# Altium schematic sheet LevelShift.SchDoc
size A4; CompanyName2: TH Nürnberg; Author: T. Kreppel; CompanyName: Universidad de Santiago de Chile; Organization: USACH DIE; Address1: Avenida Ecuador Nº 3519; Address2: Estación Central, Santiago90489 Nürnberg; Address3: Chile; SheetNumber: 3; SheetTotal: 5
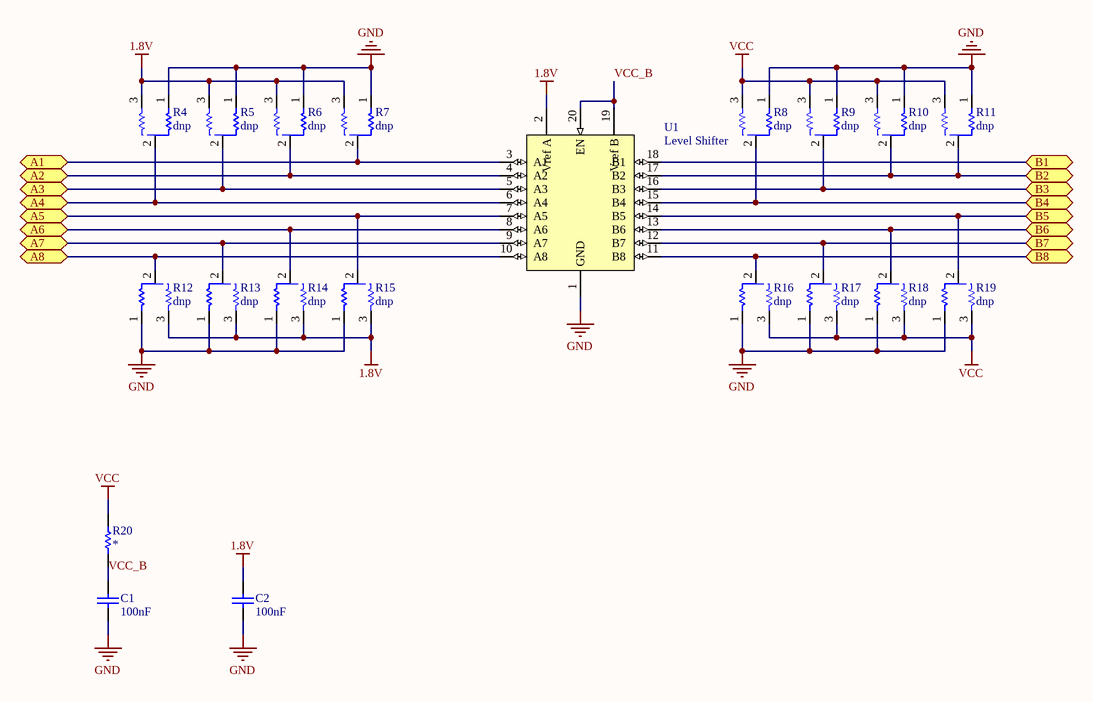
[diagram p0: LevelShift.SchDoc]

## Parts
C1  100nF  [CAP_0603]
C2  100nF  [CAP_0603]
R4  dnp  [0603_Config]
R5  dnp  [0603_Config]
R6  dnp  [0603_Config]
R7  dnp  [0603_Config]
R8  dnp  [0603_Config]
R9  dnp  [0603_Config]
R10  dnp  [0603_Config]
R11  dnp  [0603_Config]
R12  dnp  [0603_Config]
R13  dnp  [0603_Config]
R14  dnp  [0603_Config]
R15  dnp  [0603_Config]
R16  dnp  [0603_Config]
R17  dnp  [0603_Config]
R18  dnp  [0603_Config]
R19  dnp  [0603_Config]
R20  *  [RES_0603]
U1  Level Shifter  [TSOP65P640X120-20N]

## Ports
A1 (bidir), A2 (bidir), A3 (bidir), A4 (bidir), A5 (bidir), A6 (bidir), A7 (bidir), A8 (bidir), B1 (bidir), B2 (bidir), B3 (bidir), B4 (bidir), B5 (bidir), B6 (bidir), B7 (bidir), B8 (bidir)

## Nets
1.8V: C2.1 R4.3 R5.3 R6.3 R7.3 R12.3 R13.3 R14.3 R15.3 U1.2(Vref_A)
GND: C1.2 C2.2 R4.1 R5.1 R6.1 R7.1 R8.1 R9.1 R10.1 R11.1 R12.1 R13.1 R14.1 R15.1 R16.1 R17.1 R18.1 R19.1 U1.1(GND)
VCC: R8.3 R9.3 R10.3 R11.3 R16.3 R17.3 R18.3 R19.3 R20.2
A1: R7.2 U1.3(A1) ; port A1
A2: R6.2 U1.4(A2) ; port A2
A3: R5.2 U1.5(A3) ; port A3
A4: R4.2 U1.6(A4) ; port A4
A5: R15.2 U1.7(A5) ; port A5
A6: R14.2 U1.8(A6) ; port A6
A7: R13.2 U1.9(A7) ; port A7
A8: R12.2 U1.10(A8) ; port A8
B1: U1.18(B1) ; port B1
B2: R10.2 R11.2 U1.17(B2) ; port B2
B3: R9.2 U1.16(B3) ; port B3
B4: R8.2 U1.15(B4) ; port B4
B5: R19.2 U1.14(B5) ; port B5
B6: R18.2 U1.13(B6) ; port B6
B7: R17.2 U1.12(B7) ; port B7
B8: R16.2 U1.11(B8) ; port B8
VCC_B: C1.1 R20.1 U1.19(Vref_B) U1.20(EN)

## Notes on the sheet
- Title
- Size:
- Date:
- A4
- Revision:
- Time:
- Sheet
- of
- Author:
- Project:

## Library data of the parts
C1 C2 = Cap_0603: Capacitor; Manufacturer Part-Number: LD03YC104KAB2A; Rule: PcbType=ProtelPcb; Published: 8-Jun-2000; LatestRevisionDate: 17-Jul-2002; LatestRevisionNote: Re-released for DXP Platform.; PackageReference: RAD-0.3; Publisher: Altium Limited; Value: 100nF; Digikey Part-Number: 478-4929-1-ND
R4-R19 = R_config: Solder 0603 resistor/jumper between pads 1 and 2 for standard function. Solter resistor between pads 2 and 3 for alternative function; MPN: MCWR06X1002FTL; Value: 0R; MF: Multicomp; Voltage: 50V; Power: 100mW; Tolerance: 1%; Created: 2018_09_04_AGeiger; Package: 0603; Supplier Part Number 1: 2447230; Supplier 1: Farnell
R20 = Res0603: Published: 8-Jun-2000; LatestRevisionDate: 17-Jul-2002; LatestRevisionNote: Re-released for DXP Platform.; PackageReference: AXIAL-0.3; Publisher: Altium Limited; PackageDescription: Axial Device, Thru-Hole; 2 Leads; 0.3 in Pin Spacing; Digikey Part-Number: *; Value: *
U1 = LSF0108: 8-Channel, Bidirectional, Low Delay, Multi-Voltage Level Translator; MPN: LSF0108PWR; MF: Texas Instruments; Created: 2020_05_Kreppel; Supplier 1: Digikey; Supplier Part Number 1: 296-37828-1-ND